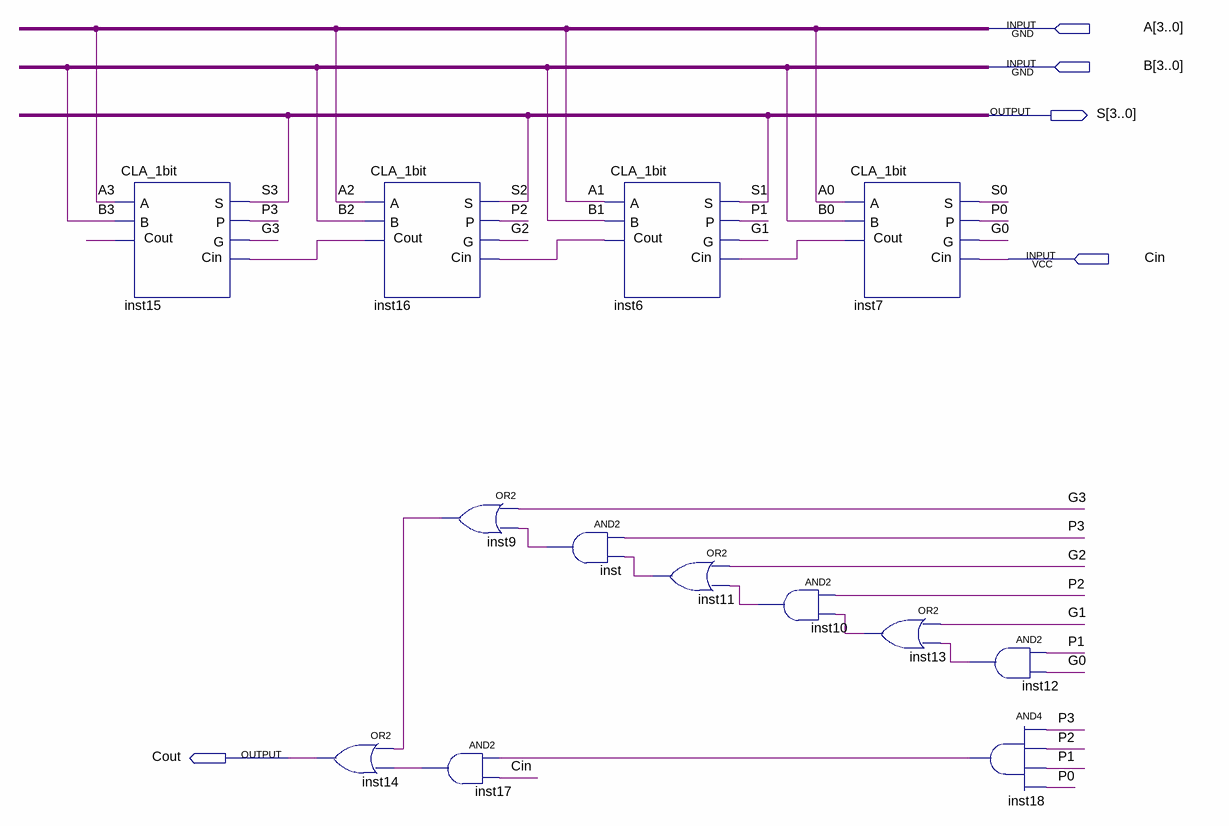
[diagram p0: schematic sheet]
// Quartus schematic CLA_4bits.bdf as structural Verilog: 13 symbols, 5 pins
module CLA_4bits (
  input  [3:0] A,
  input  [3:0] B,
  input  Cin,
  output [3:0] S,
  output Cout
);

  wire G0, G1, G2, G3, inst6_cout, inst7_cout, inst9_out, inst10_out, inst11_out, inst12_out, inst13_out,
       inst15_cout, inst16_cout, inst17_out, inst18_out, inst_out, P0, P1, P2, P3;

  CLA_1bit inst15 (.A(A[3]), .B(B[3]), .Cin(inst16_cout), .S(S[3]), .P(P3), .G(G3), .Cout(inst15_cout));
  or inst14 (Cout, inst9_out, inst17_out);
  CLA_1bit inst16 (.A(A[2]), .B(B[2]), .Cin(inst6_cout), .S(S[2]), .P(P2), .G(G2), .Cout(inst16_cout));
  and inst17 (inst17_out, inst18_out, Cin);
  or inst9 (inst9_out, G3, inst_out);
  and inst (inst_out, P3, inst11_out);
  CLA_1bit inst6 (.A(A[1]), .B(B[1]), .Cin(inst7_cout), .S(S[1]), .P(P1), .G(G1), .Cout(inst6_cout));
  or inst11 (inst11_out, G2, inst10_out);
  and inst10 (inst10_out, P2, inst13_out);
  CLA_1bit inst7 (.A(A[0]), .B(B[0]), .Cin(Cin), .S(S[0]), .P(P0), .G(G0), .Cout(inst7_cout));
  or inst13 (inst13_out, G1, inst12_out);
  and inst12 (inst12_out, P1, G0);
  and inst18 (inst18_out, P3, P2, P1, P0);
endmodule
